# EAGLE schematic 20190801_MemEx_v1.1 (EAGLE 9.6.0)
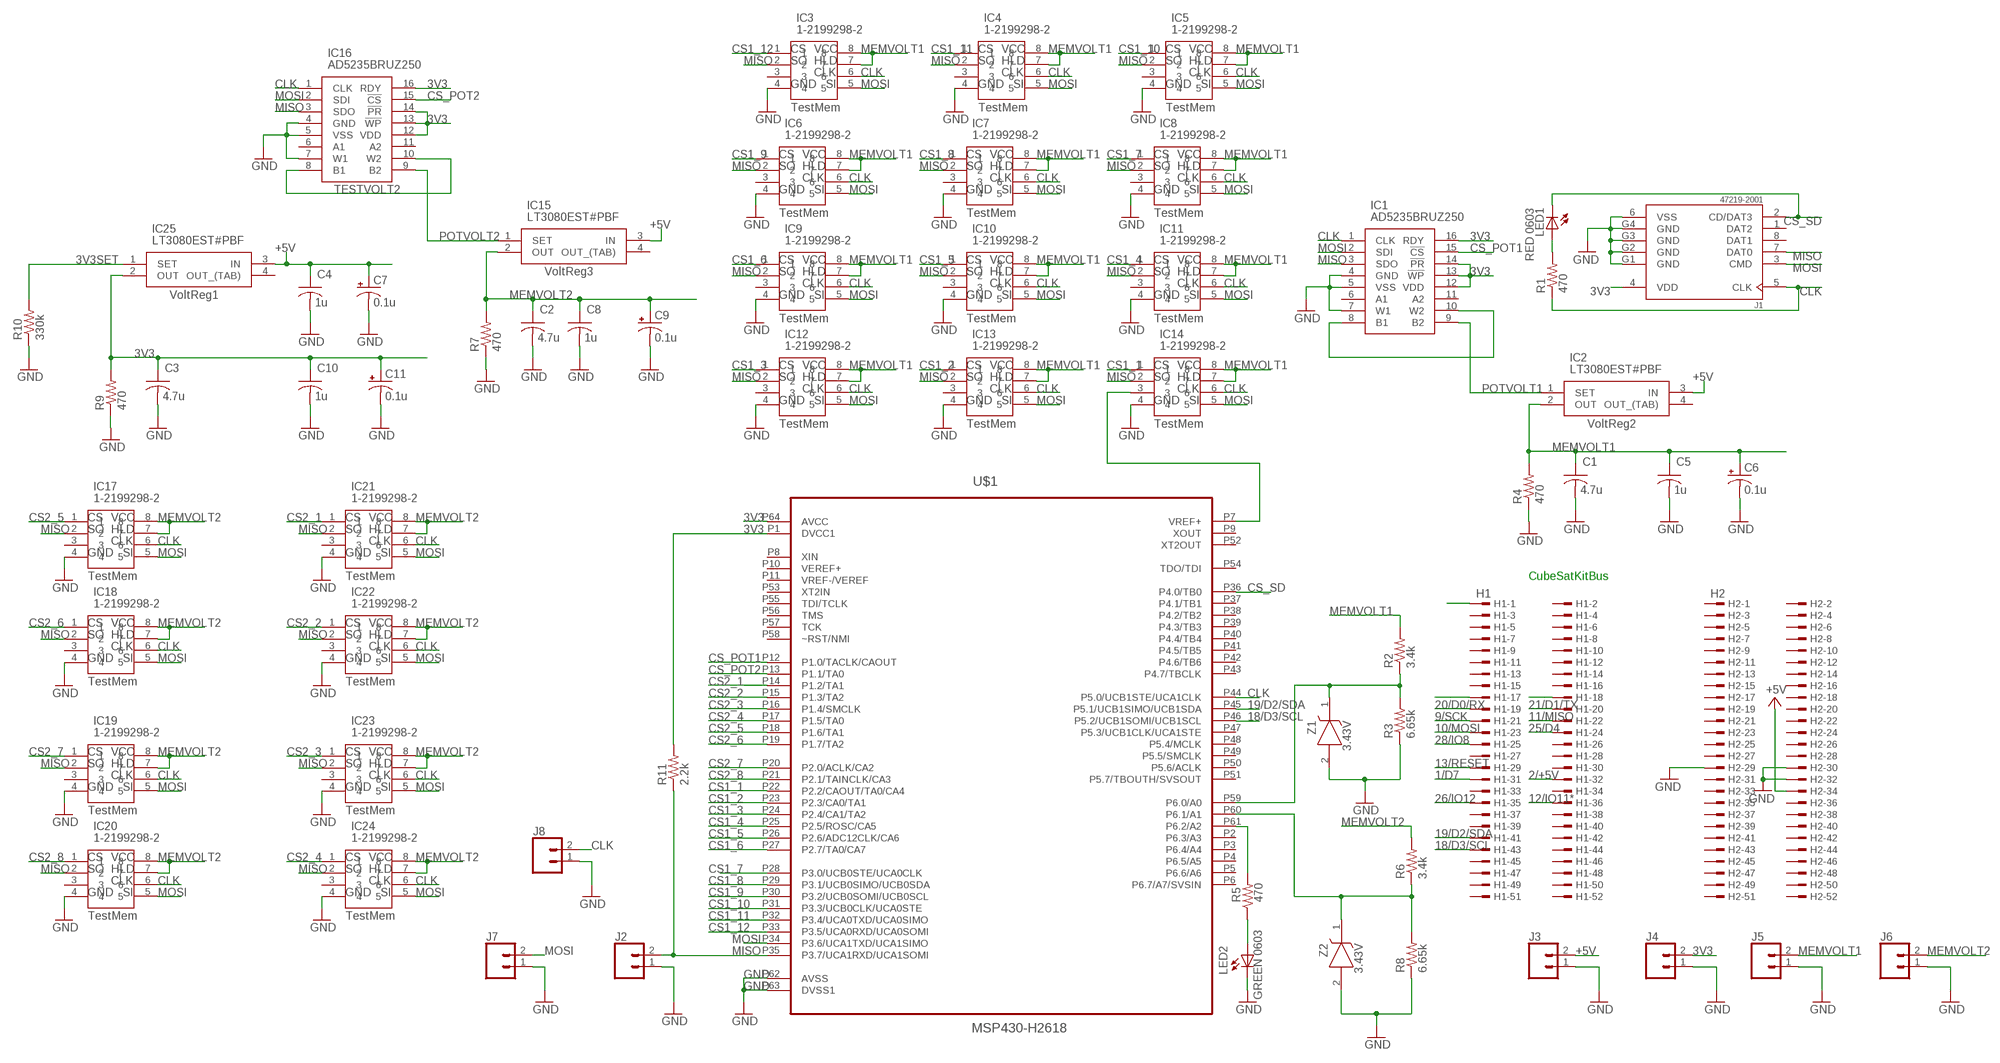
[diagram p0: schematic, sheet 1]

## Parts
C1  4.7u  C-USC0805K  [C0805K]
C2  4.7u  C-USC0805K  [C0805K]
C3  4.7u  C-USC0805K  [C0805K]
C4  1u  C-USC0805K  [C0805K]
C5  1u  C-USC0805K  [C0805K]
C6  0.1u  CPOL-US153CLV-0405  [153CLV-0405]
C7  0.1u  CPOL-US153CLV-0405  [153CLV-0405]
C8  1u  C-USC0805K  [C0805K]
C9  0.1u  CPOL-US153CLV-0405  [153CLV-0405]
C10  1u  C-USC0805K  [C0805K]
C11  0.1u  CPOL-US153CLV-0405  [153CLV-0405]
H1  H1  TSW-126-07-G-D  [TSW-126-XX-G-D]
H2  H2  TSW-126-07-G-D  [TSW-126-XX-G-D]
IC1  AD5235BRUZ250  [SOP65P640X120-16N]
IC2  LT3080EST#PBF  [SOT230P700X180-4N]
IC3  1-2199298-2  [DIPS762W70P254L1016H510Q8N]
IC4  1-2199298-2  [DIPS762W70P254L1016H510Q8N]
IC5  1-2199298-2  [DIPS762W70P254L1016H510Q8N]
IC6  1-2199298-2  [DIPS762W70P254L1016H510Q8N]
IC7  1-2199298-2  [DIPS762W70P254L1016H510Q8N]
IC8  1-2199298-2  [DIPS762W70P254L1016H510Q8N]
IC9  1-2199298-2  [DIPS762W70P254L1016H510Q8N]
IC10  1-2199298-2  [DIPS762W70P254L1016H510Q8N]
IC11  1-2199298-2  [DIPS762W70P254L1016H510Q8N]
IC12  1-2199298-2  [DIPS762W70P254L1016H510Q8N]
IC13  1-2199298-2  [DIPS762W70P254L1016H510Q8N]
IC14  1-2199298-2  [DIPS762W70P254L1016H510Q8N]
IC15  LT3080EST#PBF  [SOT230P700X180-4N]
IC16  AD5235BRUZ250  [SOP65P640X120-16N]
IC17  1-2199298-2  [DIPS762W70P254L1016H510Q8N]
IC18  1-2199298-2  [DIPS762W70P254L1016H510Q8N]
IC19  1-2199298-2  [DIPS762W70P254L1016H510Q8N]
IC20  1-2199298-2  [DIPS762W70P254L1016H510Q8N]
IC21  1-2199298-2  [DIPS762W70P254L1016H510Q8N]
IC22  1-2199298-2  [DIPS762W70P254L1016H510Q8N]
IC23  1-2199298-2  [DIPS762W70P254L1016H510Q8N]
IC24  1-2199298-2  [DIPS762W70P254L1016H510Q8N]
IC25  LT3080EST#PBF  [SOT230P700X180-4N]
J1  47219-2001  [MOLEX_47219-2001]
J2  CONN_02  [1X02]
J3  CONN_02  [1X02]
J4  CONN_02  [1X02]
J5  CONN_02  [1X02]
J6  CONN_02  [1X02]
J7  CONN_02  [1X02]
J8  CONN_02  [1X02]
LED1  RED 0603  LEDCHIPLED_0603  [CHIPLED_0603]
LED2  GREEN 0603  LEDCHIPLED_0603  [CHIPLED_0603]
R1  470  R-US_R0603  [R0603]
R2  3.4k  R-US_R0603  [R0603]
R3  6.65k  R-US_R0603  [R0603]
R4  470  R-US_R0603  [R0603]
R5  470  R-US_R0603  [R0603]
R6  3.4k  R-US_R0603  [R0603]
R7  470  R-US_R0603  [R0603]
R8  6.65k  R-US_R0603  [R0603]
R9  470  R-US_R0603  [R0603]
R10  330k  R-US_R0603  [R0603]
R11  2.2k  R-US_R0603  [R0603]
U$1  MSP430-H2618  [MSP430-H2618]
Z1  3.43V  PLZ3V3B-G3_H  [SODFL2513X70N]
Z2  3.43V  PLZ3V3B-G3_H  [SODFL2513X70N]

## Nets
1/D7: H1.31
2/+5V: H1.32
3V3: C3.1 C10.1 C11.+ IC1.12(VDD) IC1.13(!WP) IC1.14(!PR) IC1.16(RDY) IC16.12(VDD) IC16.13(!WP) IC16.14(!PR) IC16.16(RDY) IC25.2(OUT) J1.4(VDD) J4.2 R9.2 R11.2 U$1.P1(DVCC1) U$1.P64(AVCC)
3V3SET: IC25.1(SET) R10.2
9/SCK: H1.21
10/MOSI: H1.23
11/MISO: H1.22
12/IO11*: H1.36
13/RESET: H1.29
18/D3/SCL: H1.43 U$1.P46(P5.2/UCB1SOMI/UCB1SCL)
19/D2/SDA: H1.41 U$1.P45(P5.1/UCB1SIMO/UCB1SDA)
20/D0/RX: H1.19
21/D1/TX: H1.20
25/D4: H1.24
26/IO12: H1.35
28/IO8: H1.25
+5V [usbvcc]: C4.1 C7.+ H2.34 IC2.3(IN) IC15.3(IN) IC25.3(IN) J3.2
CLK: IC1.1(CLK) IC3.6 IC4.6 IC5.6 IC6.6 IC7.6 IC8.6 IC9.6 IC10.6 IC11.6 IC12.6 IC13.6 IC14.6 IC16.1(CLK) IC17.6 IC18.6 IC19.6 IC20.6 IC21.6 IC22.6 IC23.6 IC24.6 J1.5(CLK) J8.2 R1.1 U$1.P44(P5.0/UCB1STE/UCA1CLK)
CS1_1: IC14.1 U$1.P22(P2.2/CAOUT/TA0/CA4)
CS1_2: IC13.1 U$1.P23(P2.3/CA0/TA1)
CS1_3: IC12.1 U$1.P24(P2.4/CA1/TA2)
CS1_4: IC11.1 U$1.P25(P2.5/ROSC/CA5)
CS1_5: IC10.1 U$1.P26(P2.6/ADC12CLK/CA6)
CS1_6: IC9.1 U$1.P27(P2.7/TA0/CA7)
CS1_7: IC8.1 U$1.P28(P3.0/UCB0STE/UCA0CLK)
CS1_8: IC7.1 U$1.P29(P3.1/UCB0SIMO/UCB0SDA)
CS1_9: IC6.1 U$1.P30(P3.2/UCB0SOMI/UCB0SCL)
CS1_10: IC5.1 U$1.P31(P3.3/UCB0CLK/UCA0STE)
CS1_11: IC4.1 U$1.P32(P3.4/UCA0TXD/UCA0SIMO)
CS1_12: IC3.1 U$1.P33(P3.5/UCA0RXD/UCA0SOMI)
CS2_1: IC21.1 U$1.P14(P1.2/TA1)
CS2_2: IC22.1 U$1.P15(P1.3/TA2)
CS2_3: IC23.1 U$1.P16(P1.4/SMCLK)
CS2_4: IC24.1 U$1.P17(P1.5/TA0)
CS2_5: IC17.1 U$1.P18(P1.6/TA1)
CS2_6: IC18.1 U$1.P19(P1.7/TA2)
CS2_7: IC19.1 U$1.P20(P2.0/ACLK/CA2)
CS2_8: IC20.1 U$1.P21(P2.1/TAINCLK/CA3)
CS_POT1: IC1.15(!CS) U$1.P12(P1.0/TACLK/CAOUT)
CS_POT2: IC16.15(!CS) U$1.P13(P1.1/TA0)
CS_SD: J1.2(CD/DAT3) LED1.C U$1.P36(P4.0/TB0)
GND [power]: C1.2 C2.2 C3.2 C4.2 C5.2 C6.- C7.- C8.2 C9.- C10.2 C11.- H2.29 H2.30 H2.32 IC1.4(GND) IC1.5(VSS) IC1.7(W1) IC3.4 IC4.4 IC5.4 IC6.4 IC7.4 IC8.4 IC9.4 IC10.4 IC11.4 IC12.4 IC13.4 IC14.4 IC16.4(GND) IC16.5(VSS) IC16.7(W1) IC17.4 IC18.4 IC19.4 IC20.4 IC21.4 IC22.4 IC23.4 IC24.4 J1.6(VSS) J1.G1(GND) J1.G2(GND) J1.G3(GND) J1.G4(GND) J2.1 J3.1 J4.1 J5.1 J6.1 J7.1 J8.1 LED2.C R3.1 R4.1 R7.1 R8.1 R9.1 R10.1 U$1.P62(AVSS) U$1.P63(DVSS1) Z1.2(A) Z2.2(A)
MEMVOLT1: C1.1 C5.1 C6.+ IC2.2(OUT) IC3.7 IC3.8 IC4.7 IC4.8 IC5.7 IC5.8 IC6.7 IC6.8 IC7.7 IC7.8 IC8.7 IC8.8 IC9.7 IC9.8 IC10.7 IC10.8 IC11.7 IC11.8 IC12.7 IC12.8 IC13.7 IC13.8 IC14.7 IC14.8 J5.2 R2.2 R4.2
MEMVOLT2: C2.1 C8.1 C9.+ IC15.2(OUT) IC17.7 IC17.8 IC18.7 IC18.8 IC19.7 IC19.8 IC20.7 IC20.8 IC21.7 IC21.8 IC22.7 IC22.8 IC23.7 IC23.8 IC24.7 IC24.8 J6.2 R6.2 R7.2
MISO: IC1.3(SDO) IC3.2 IC4.2 IC5.2 IC6.2 IC7.2 IC8.2 IC9.2 IC10.2 IC11.2 IC12.2 IC13.2 IC14.2 IC16.3(SDO) IC17.2 IC18.2 IC19.2 IC20.2 IC21.2 IC22.2 IC23.2 IC24.2 J1.7(DAT0) J2.2 R11.1 U$1.P35(P3.7/UCA1RXD/UCA1SOMI)
MOSI: IC1.2(SDI) IC3.5 IC4.5 IC5.5 IC6.5 IC7.5 IC8.5 IC9.5 IC10.5 IC11.5 IC12.5 IC13.5 IC14.5 IC16.2(SDI) IC17.5 IC18.5 IC19.5 IC20.5 IC21.5 IC22.5 IC23.5 IC24.5 J1.3(CMD) J7.2 U$1.P34(P3.6/UCA1TXD/UCA1SIMO)
N$1: R5.2 U$1.P61(P6.2/A2)
N$2: H1.1
N$3: LED2.A R5.1
N$4: LED1.A R1.2
N$5: R6.1 R8.2 U$1.P60(P6.1/A1) Z2.1(K)
N$6: IC14.3 U$1.P7(VREF+)
N$11: H1.18
N$12: H1.17
N$19: R2.1 R3.2 U$1.P59(P6.0/A0) Z1.1(K)
POTVOLT1: IC1.9(B2) IC2.1(SET)
POTVOLT2: IC15.1(SET) IC16.9(B2)
TESTVOLT1: IC1.8(B1) IC1.10(W2)
TESTVOLT2: IC16.8(B1) IC16.10(W2)
Unconnected: H1.2 H1.3 H1.4 H1.5 H1.6 H1.7 H1.8 H1.9 H1.10 H1.11 H1.12 H1.13 H1.14 H1.15 H1.16 H1.26 H1.27 H1.28 H1.30 H1.33 H1.34 H1.37 H1.38 H1.39 H1.40 H1.42 H1.44 H1.45 H1.46 H1.47 H1.48 H1.49 H1.50 H1.51 H1.52 H2.1 H2.2 H2.3 H2.4 H2.5 H2.6 H2.7 H2.8 H2.9 H2.10 H2.11 H2.12 H2.13 H2.14 H2.15 H2.16 H2.17 H2.18 H2.19 H2.20 H2.21 H2.22 H2.23 H2.24 H2.25 H2.26 H2.27 H2.28 H2.31 H2.33 H2.35 H2.36 H2.37 H2.38 H2.39 H2.40 H2.41 H2.42 H2.43 H2.44 H2.45 H2.46 H2.47 H2.48 H2.49 H2.50 H2.51 H2.52 IC1.6(A1) IC1.11(A2) IC2.4(OUT_(TAB)) IC3.3 IC4.3 IC5.3 IC6.3 IC7.3 IC8.3 IC9.3 IC10.3 IC11.3 IC12.3 IC13.3 IC15.4(OUT_(TAB)) IC16.6(A1) IC16.11(A2) IC17.3 IC18.3 IC19.3 IC20.3 IC21.3 IC22.3 IC23.3 IC24.3 IC25.4(OUT_(TAB)) J1.1(DAT2) J1.8(DAT1) U$1.P2(P6.3/A3) U$1.P3(P6.4/A4) U$1.P4(P6.5/A5) U$1.P5(P6.6/A6) U$1.P6(P6.7/A7/SVSIN) U$1.P8(XIN) U$1.P9(XOUT) U$1.P10(VEREF+) U$1.P11(VREF-/VEREF) U$1.P37(P4.1/TB1) U$1.P38(P4.2/TB2) U$1.P39(P4.3/TB3) U$1.P40(P4.4/TB4) U$1.P41(P4.5/TB5) U$1.P42(P4.6/TB6) U$1.P43(P4.7/TBCLK) U$1.P47(P5.3/UCB1CLK/UCA1STE) U$1.P48(P5.4/MCLK) U$1.P49(P5.5/SMCLK) U$1.P50(P5.6/ACLK) U$1.P51(P5.7/TBOUTH/SVSOUT) U$1.P52(XT2OUT) U$1.P53(XT2IN) U$1.P54(TDO/TDI) U$1.P55(TDI/TCLK) U$1.P56(TMS) U$1.P57(TCK) U$1.P58(~RST/NMI)

## Notes on the sheet
- CS | VCC | CS | VCC | CS | VCC
- SO | HLD | SO | HLD | SO | HLD
- CLK | CLK | CLK
- GND | SI | GND | SI | GND | SI
- TestMem | TestMem | TestMem
- CS | VCC | CS | VCC | CS | VCC
- SO | HLD | SO | HLD | SO | HLD
- CLK | CLK | CLK
- GND | SI | GND | SI | GND | SI
- TestMem | TestMem | TestMem
- CS | VCC | CS | VCC | CS | VCC
- VoltReg3 | SO | HLD | SO | HLD | SO | HLD
- CLK | CLK | CLK
- VoltReg1 | GND | SI | GND | SI | GND | SI
- TestMem | TestMem | TestMem
- CS | VCC | CS | VCC | CS | VCC
- SO | HLD | SO | HLD | SO | HLD
- CLK | CLK | CLK
- GND | SI | GND | SI | GND | SI
- TestMem | TestMem | TestMem | VoltReg2
- CS | VCC | CS | VCC
- SO | HLD | SO | HLD
- CLK | CLK
- GND | SI | GND | SI
- TestMem | TestMem | CubeSatKitBus
- CS | VCC | CS | VCC
- SO | HLD | SO | HLD
- CLK | CLK
- GND | SI | GND | SI
- TestMem | TestMem
- CS | VCC | CS | VCC
- SO | HLD | SO | HLD
- CLK | CLK
- GND | SI | GND | SI
- TestMem | TestMem
- CS | VCC | CS | VCC
- SO | HLD | SO | HLD
- CLK | CLK
- GND | SI | GND | SI
- TestMem | TestMem

## Library data of the parts
C1-C5 C8 C10 = rcl:C-US: CAPACITOR, American symbol; SPICEPREFIX: C
C6 C7 C9 C11 = rcl:CPOL-US: POLARIZED CAPACITOR, American symbol; SPICEPREFIX: C
H1 H2 = con-samtec:TSW-126-*-G: THROUGH-HOLE .025" SQ POST HEADER Source: Samtec TSW.pdf; MF: Samtec Inc.; MPN: TSW-126-07-G-D
IC1 IC16 = AD5235BRUZ250:AD5235BRUZ250: AD5235BRUZ250 256-step dual pot, 250K AD5235BRUZ250, Digital Potentiometer 250k 1024-Position Linear, Log 2-channel Serial-4 Wire, Serial-SPI 16-Pin TSSOP Source: Datasheet <http://docs-emea.rs-online.com/webdocs/04f6/0900766b804f6cf5.pdf>; DESCRIPTION: AD5235BRUZ250 256-step dual pot, 250K AD5235BRUZ250, Digital Potentiometer 250k 1024-Position Linear, Log 2-channel Serial-4 Wire, Serial-SPI 16-Pin TSSOP; HEIGHT: 1.2mm; MANUFACTURER_NAME: Analog Devices; MANUFACTURER_PART_NUMBER: AD5235BRUZ250; MOUSER_PART_NUMBER: 584-AD5235BRUZ250; MOUSER_PRICE-STOCK: https://www.mouser.com/Search/Refine.aspx?Keyword=584-AD5235BRUZ250; RS_PART_NUMBER: 0228536; RS_PRICE-STOCK: http://uk.rs-online.com/web/p/products/0228536
IC2 IC15 IC25 = LT3080EST#PBF:LT3080EST#PBF: Adjust single Resistor 1.1A LDO LT3080 LT3080EST#PBF, Low Dropout Voltage Regulator, Adjustable 1.1A, 0 30 V, 4-Pin SOT-223 Source: Datasheet <http://docs-emea.rs-online.com/webdocs/0b06/0900766b80b06792.pdf>; DESCRIPTION: Adjust single Resistor 1.1A LDO LT3080 LT3080EST#PBF, Low Dropout Voltage Regulator, Adjustable 1.1A, 0 30 V, 4-Pin SOT-223; HEIGHT: 1.8mm; MANUFACTURER_NAME: Linear Technology; MANUFACTURER_PART_NUMBER: LT3080EST#PBF; MOUSER_PART_NUMBER: 584-LT3080EST#PBF; MOUSER_PRICE-STOCK: https://www.mouser.com/Search/Refine.aspx?Keyword=584-LT3080EST%23PBF; RS_PART_NUMBER: 9173453; RS_PRICE-STOCK: https://uk.rs-online.com/web/p/products/9173453
IC3-IC14 IC17-IC24 = 1-2199298-2:1-2199298-2: TE CONNECTIVITY - 1-2199298-2 - IC SOCKET, DIP, 8POS, TH Source: Datasheet <https://componentsearchengine.com/Datasheets/2/1-2199298-2.pdf>; ALLIED_NUMBER: 71373899; ALLIED_PRICE-STOCK: https://www.alliedelec.com/teconnectivity-1-2199298-2/71373899/; DESCRIPTION: TE CONNECTIVITY - 1-2199298-2 - IC SOCKET, DIP, 8POS, TH; HEIGHT: 5.1mm; MANUFACTURER_NAME: TE Connectivity; MANUFACTURER_PART_NUMBER: 1-2199298-2; MOUSER_PART_NUMBER: 571-1-2199298-2; MOUSER_PRICE-STOCK: https://www.mouser.com/Search/Refine.aspx?Keyword=571-1-2199298-2; RS_PART_NUMBER: 1859254; RS_PRICE-STOCK: http://uk.rs-online.com/web/p/products/1859254
J1 = molex_sd_47219-2001:47219-2001: 1.10mm Pitch microSD Card Connector, Hinge Type, Lead-Free http://www.snapeda.com/parts/47219-2001/Molex%20/%20Waldom/view-part/#; AVAILABILITY: Good; DESCRIPTION: Conn Micro SD Card SKT 8 POS 1.1mm Solder RA SMD 0.5A/Contact Embossed T/R; MF: Molex; MP: 47219-2001; PACKAGE: None; PRICE: 0.62 USD
J2-J8 = SparkFun-Connectors:CONN_02: Multi connection point. Often used as Generic Header-pin footprint for 0.1 inch spaced/style header connections On any of the 0.1 inch spaced packages, you can populate with these: Break Away Headers - Straight <https://www.sparkfun.com/products/116> (PRT-00116) Break Away Male Headers - Right Angle <https://www.sparkfun.com/products/553> (PRT-00553) Female Headers <https://www.sparkfun.com/products/115> (PRT-00115) Break Away Headers - Machine Pin <https://www.sparkfun.com/products/117> (PRT-00117) Break Away Female Headers - Swiss Machine Pin <https://www.sparkfun.com/products/743> (PRT-00743) For SCREWTERMINALS and SPRING TERMINALS visit here: Screw Terimnals on SparkFun.com <https://www.sparkfun.com/search/results?term=Screw+Terminals> (5mm/3.5mm/2.54mm spacing) This device is also useful as a general connection point to wire up your design to another part of your project. Our various solder wires solder well into these plated through hole pads. Hook-Up Wire - Assortment (Stranded, 22 AWG) <https://www.sparkfun.com/products/11375> (PRT-11375) Hook-Up Wire - Assortment (Solid Core, 22 AWG) <https://www.sparkfun.com/products/11367> (PRT-11367) View the entire wire category on our website here <https://www.sparkfun.com/categories/141> Special notes: Molex polarized connector foot print use with: PRT-08233 with associated crimp pins and housings. 2.54_SCREWTERM for use with PRT-10571. 3.5mm Screw Terminal footprints for PRT-08084 5mm Screw Terminal footprints for use with PRT-08432
LED1 LED2 = adafruit:LED: LED OSRAM: - CHIPLED LG R971, LG N971, LY N971, LG Q971, LY Q971, LO R971, LY R971 LH N974, LH R974 LS Q976, LO Q976, LY Q976 LO Q996 - Hyper CHIPLED LW Q18S LB Q993, LB Q99A, LB R99A - SideLED LS A670, LO A670, LY A670, LG A670, LP A670 LB A673, LV A673, LT A673, LW A673 LH A674 LY A675 LS A676, LA A676, LO A676, LY A676, LW A676 LS A679, LY A679, LG A679 - Hyper Micro SIDELED® LS Y876, LA Y876, LO Y876, LY Y876 LT Y87S - SmartLED LW L88C, LW L88S LB L89C, LB L89S, LG L890 LS L89K, LO L89K, LY L89K LS L896, LA L896, LO L896, LY L896 - TOPLED LS T670, LO T670, LY T670, LG T670, LP T670 LSG T670, LSP T670, LSY T670, LOP T670, LYG T670 LG T671, LOG T671, LSG T671 LB T673, LV T673, LT T673, LW T673 LH T674 LS T676, LA T676, LO T676, LY T676, LB T676, LH T676, LSB T676, LW T676 LB T67C, LV T67C, LT T67C, LS T67K, LO T67K, LY T67K, LW E67C LS E67B, LA E67B, LO E67B, LY E67B, LB E67C, LV E67C, LT E67C LW T67C LS T679, LY T679, LG T679 LS T770, LO T770, LY T770, LG T770, LP T770 LB T773, LV T773, LT T773, LW T773 LH T774 LS E675, LA E675, LY E675, LS T675 LS T776, LA T776, LO T776, LY T776, LB T776 LHGB T686 LT T68C, LB T68C - Hyper Mini TOPLED® LB M676 - Mini TOPLED Santana® LG M470 LS M47K, LO M47K, LY M47K Source: http://www.osram.convergy.de/
R1-R11 = rcl:R-US_: RESISTOR, American symbol; SPICEPREFIX: R
U$1 = MSP430-H2618:MSP430-H2618
Z1 Z2 = PLZ3V3B-G3_H:PLZ3V3B-G3_H: Zener Diodes 500mW PLZ Zener MicroSMF (DO-219AC) Source: Datasheet <https://www.vishay.com/docs/84830/plzseries.pdf>; DESCRIPTION: Zener Diodes 500mW PLZ Zener MicroSMF (DO-219AC); HEIGHT: 0.7mm; MANUFACTURER_NAME: Vishay; MANUFACTURER_PART_NUMBER: PLZ3V3B-G3/H; MOUSER_PART_NUMBER: 78-PLZ3V3B-G3/H; MOUSER_PRICE-STOCK: https://www.mouser.com/Search/Refine.aspx?Keyword=78-PLZ3V3B-G3%2FH

## Net classes
0 default: width 0.254 mm, drill 0.9 mm, clearance 0.254 mm
1 power: width 0.381 mm, drill 0.9 mm, clearance 0.254 mm
2 gnd: width 0.254 mm, drill 0.9 mm, clearance 0.254 mm
3 usbvcc: width 0.381 mm, drill 0.9 mm, clearance 0.254 mm
4 aref: width 0.254 mm, drill 0.9 mm, clearance 0.254 mm